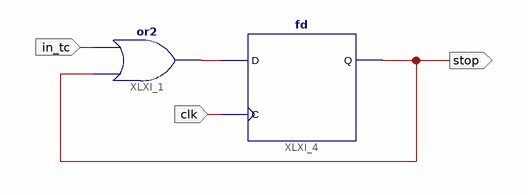
[diagram p0: schematic sheet 1]
// Xilinx ISE schematic AnalysisValues.sch (virtex6) as structural Verilog: 2 symbols, 3 ports
module AnalysisValues (
  input  in_tc,
  input  clk,
  output stop
);

  wire XLXN_3;

  or XLXI_1 (XLXN_3, stop, in_tc);
  fd XLXI_4 (.C(clk), .D(XLXN_3), .Q(stop));
endmodule
